# EAGLE schematic Tone_Control (EAGLE 6.3)
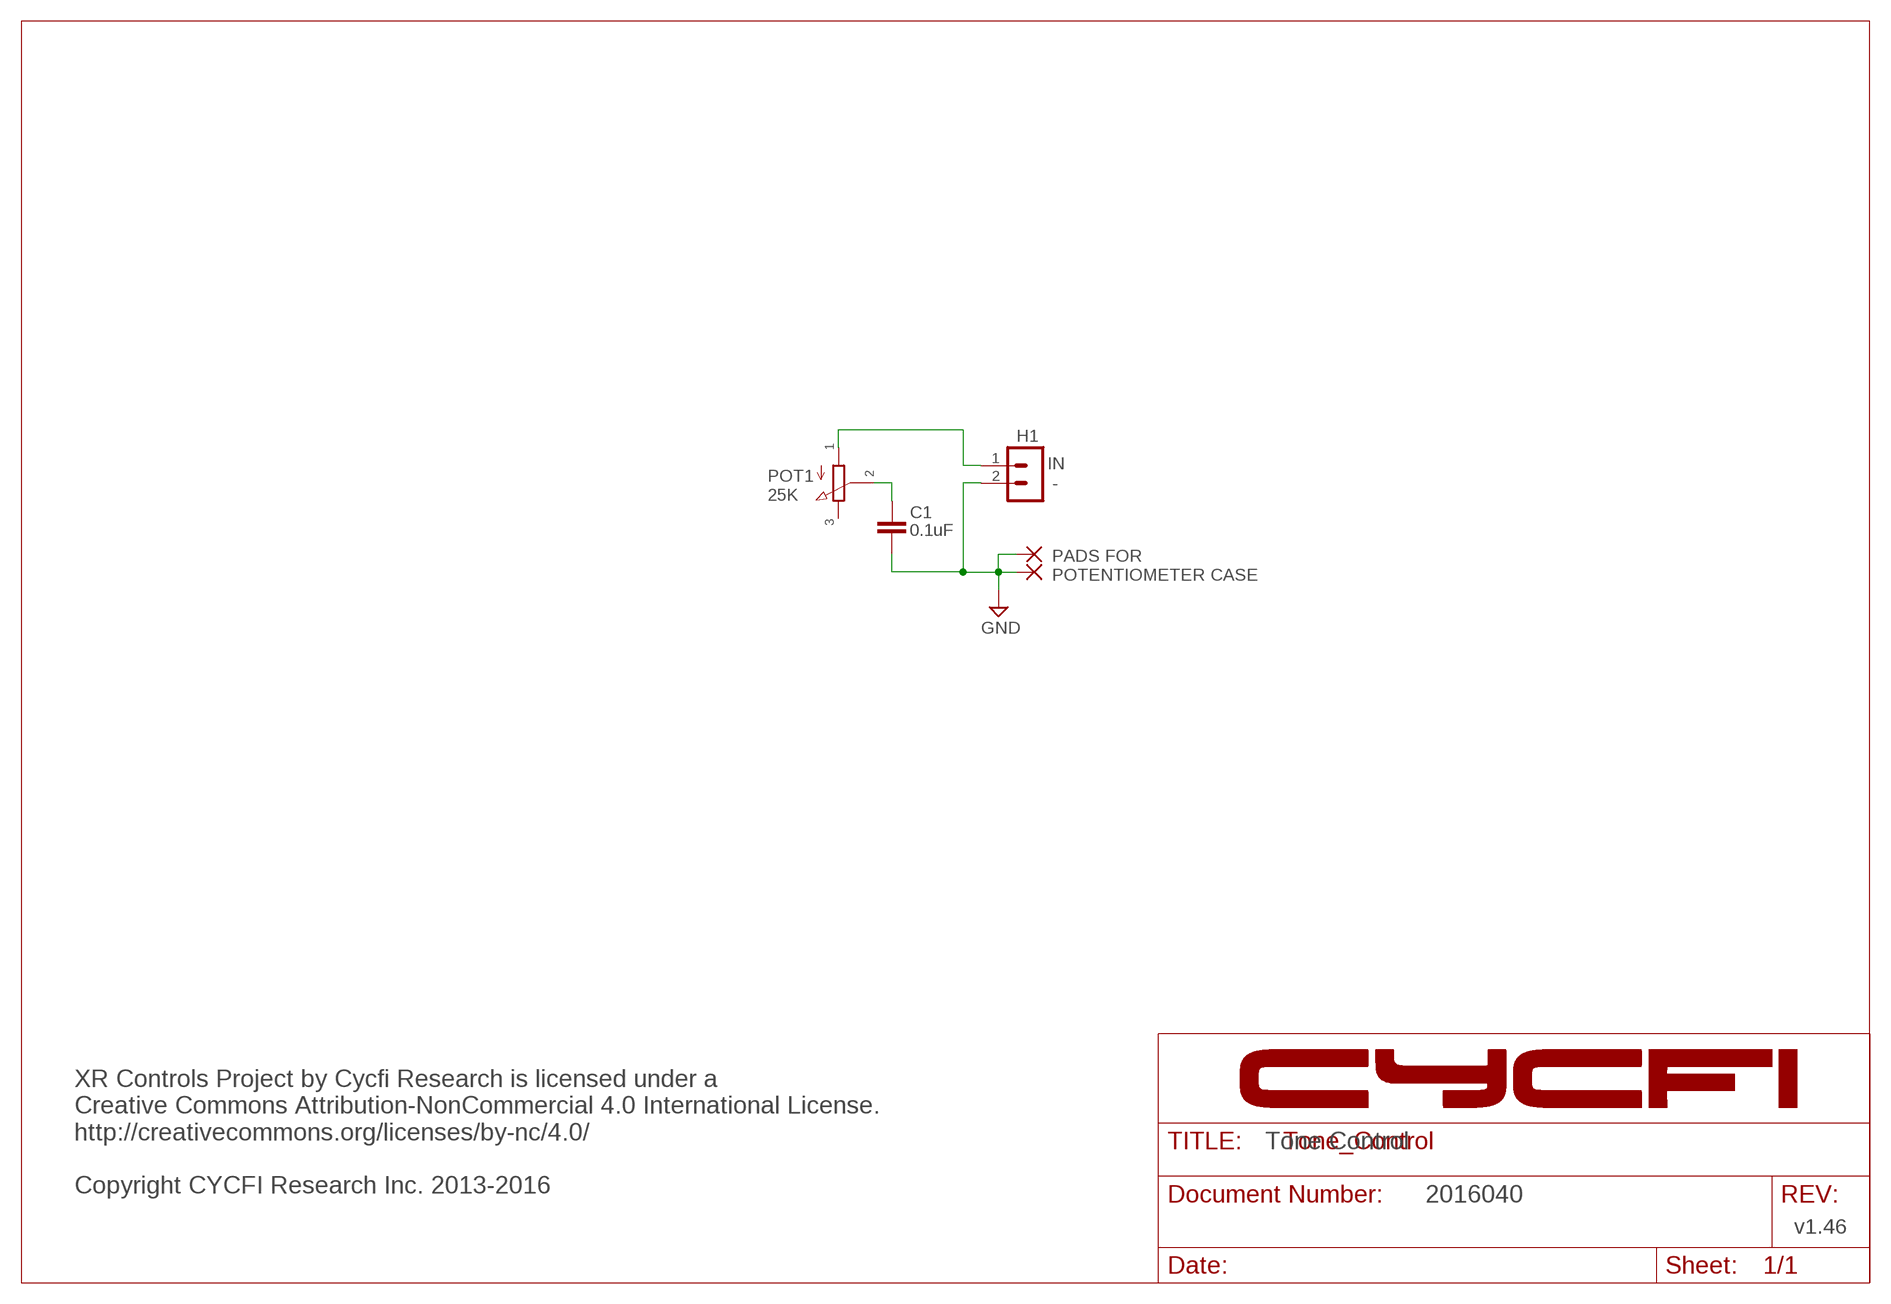
[diagram p0: schematic, sheet 1]

## Parts
C1  0.1uF  C-EUC0603  [C0603]
GND3  SMD2  [SMD1,27-2,54]
GND4  SMD2  [SMD1,27-2,54]
H1  MA02-1  [MA02-1]
POT1  PDB181-GTR01  [PDB181]

## Nets
GND: C1.1 GND3.1(P) GND4.1(P) H1.2
N$1: C1.2 POT1.P$2
N$3: H1.1 POT1.P$1
Unconnected: POT1.P$3

## Notes on the sheet
- IN
- -
- POT1
  25K
- PADS FOR 
  POTENTIOMETER CASE
- Tone Control
- XR Controls Project by Cycfi Research is licensed under a 
  Creative Commons Attribution-NonCommercial 4.0 International License. 
  http://creativecommons.org/licenses/by-nc/4.0/
  
  Copyright CYCFI Research Inc. 2013-2016
- 2016040
- v1.46

## Library data of the parts
C1 = resistor:C-EU: CAPACITOR, European symbol
GND3 GND4 = wirepad:SMD2: SMD PAD
H1 = con-lstb:MA02-1
POT1 = CYCFI_Passive:PDB181-GTR01